# EAGLE schematic hsa_stm32_board (EAGLE 6.6.0)

## Sheet 1 of 3
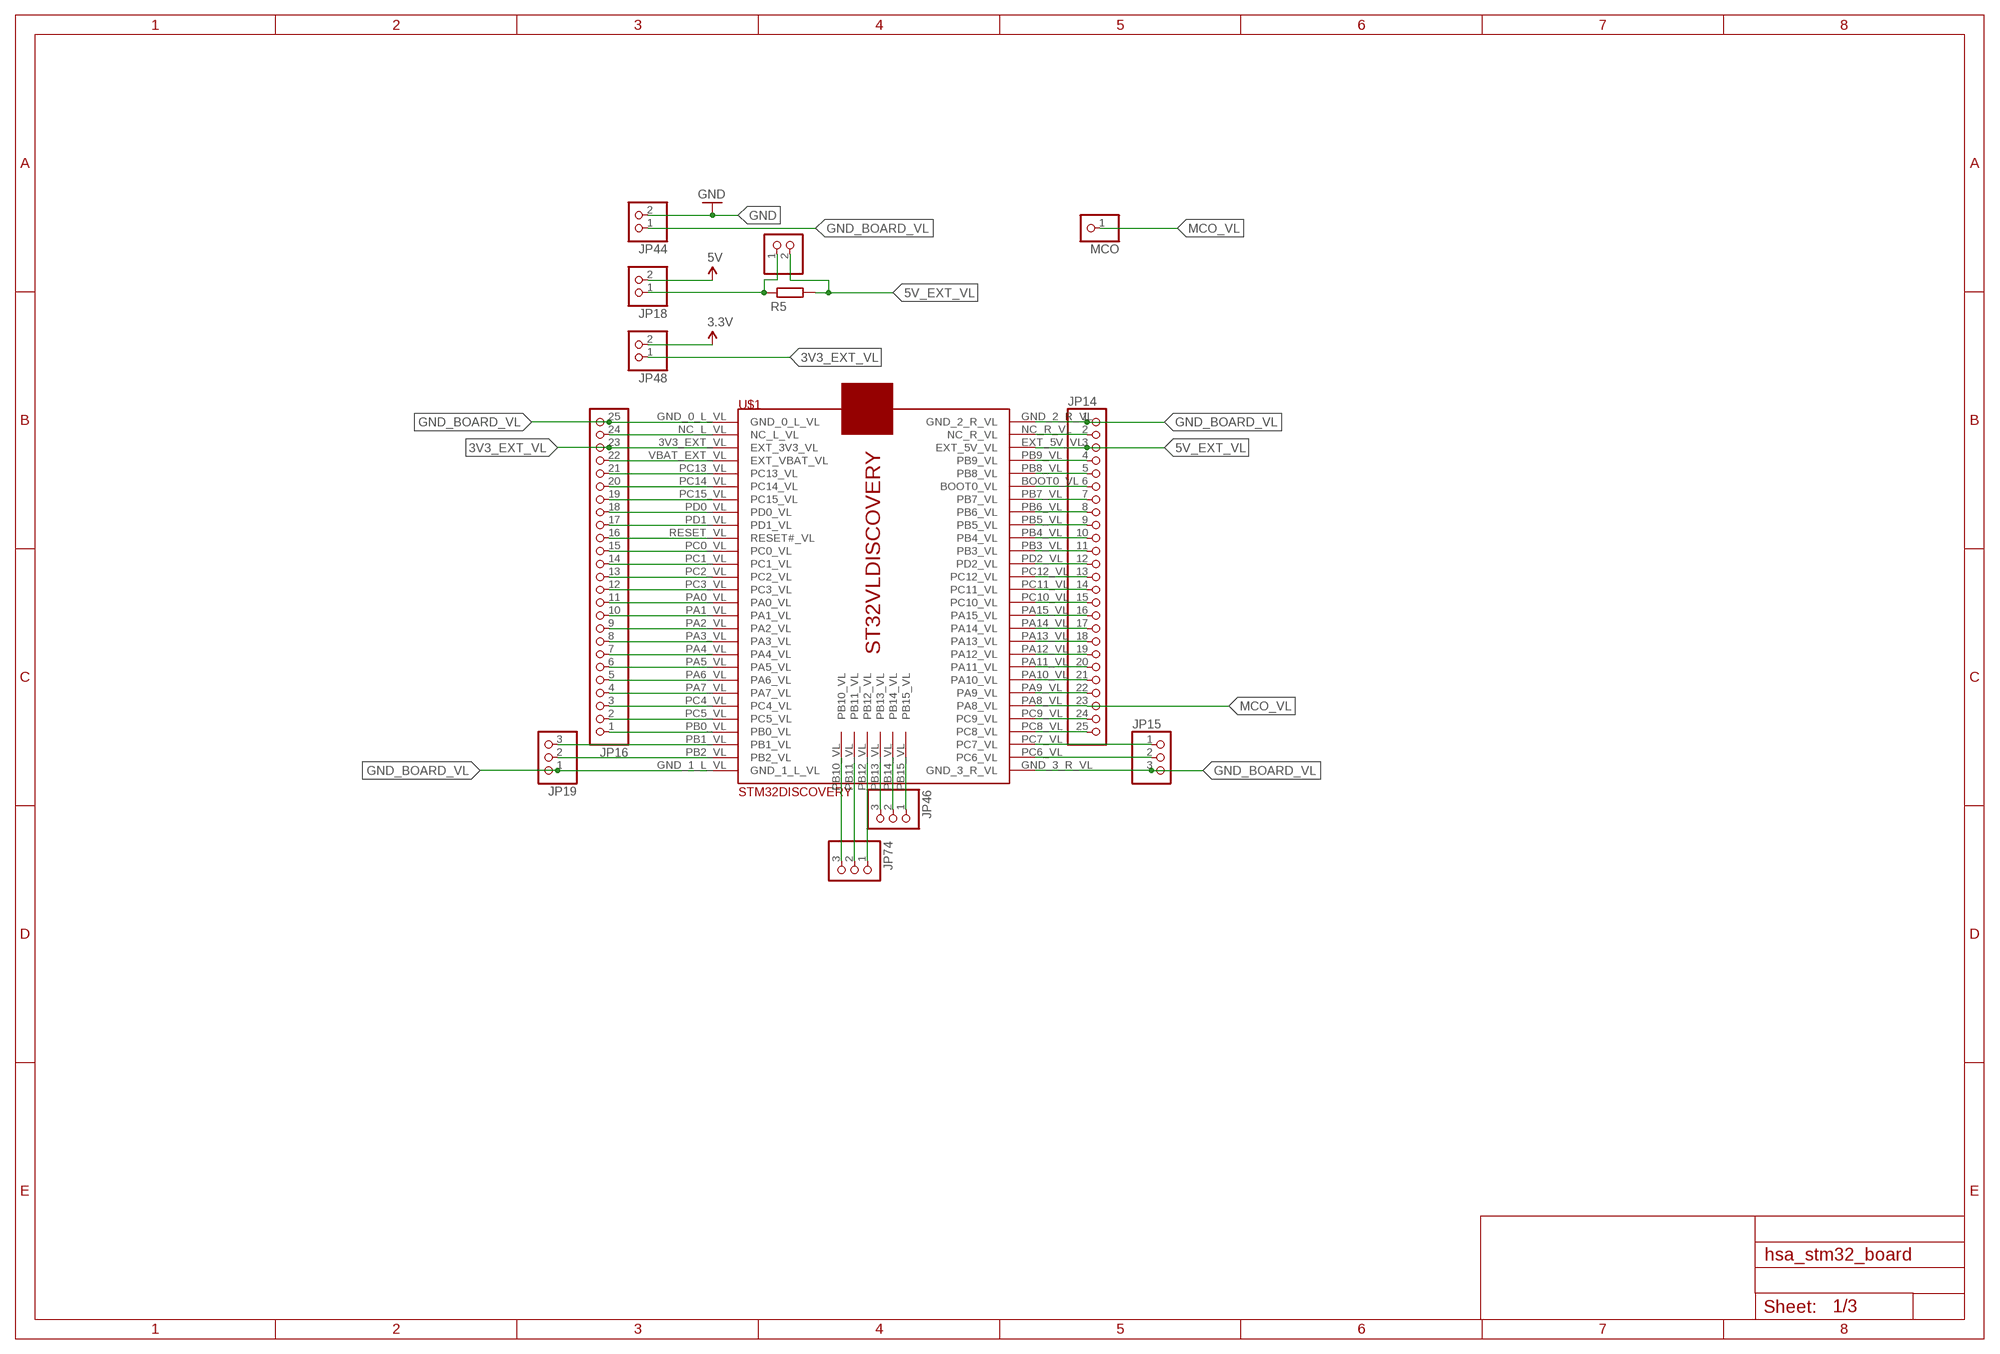
[diagram p0: schematic, sheet 1]

### Parts
JP14  PINHD-1X25  [1X25]
JP15  PINHD-1X3  [1X03]
JP16  PINHD-1X25  [1X25]
JP18  PINHD-1X2/90  [1X02/90]
JP19  PINHD-1X3  [1X03]
JP44  PINHD-1X2/90  [1X02/90]
JP46  PINHD-1X3  [1X03]
JP48  PINHD-1X2/90  [1X02/90]
JP74  PINHD-1X3  [1X03]
JP75  PINHD-1X2/90  [1X02/90]
MCO  PINHD-1X1  [1X01]
R5  R-EU_0207/10  [0207/10]
U$1  STM32DISCOVERY  [STM32DISCOVERY]

### Nets
3.3V: JP48.2 ; also sheet 2,3
3V3_EXT_VL: JP16.23 JP48.1 U$1.3V3_EXT_VL(EXT_3V3_VL)
5V: JP18.2 ; also sheet 2,3
5V_EXT_VL: JP14.3 JP75.2 R5.2 U$1.EXT_5V_VL
GND: JP44.2 ; also sheet 2,3
GND_BOARD_VL: JP14.1 JP15.3 JP16.25 JP19.1 JP44.1 U$1.GND_0_L_VL U$1.GND_1_L_VL U$1.GND_2_R_VL U$1.GND_3_R_VL
MCO_VL: JP14.23 MCO.1 U$1.PA8_VL
N$11: JP18.1 JP75.1 R5.1
N$33: JP14.2 U$1.NC_R_VL
N$35: JP14.4 U$1.PB9_VL
N$121: JP14.5 U$1.PB8_VL
N$129: JP14.6 U$1.BOOT0_VL
N$130: JP14.7 U$1.PB7_VL
N$137: JP14.8 U$1.PB6_VL
N$138: JP14.9 U$1.PB5_VL
N$154: JP14.10 U$1.PB4_VL
N$155: JP14.11 U$1.PB3_VL
N$156: JP14.12 U$1.PD2_VL
N$157: JP14.13 U$1.PC12_VL
N$158: JP14.14 U$1.PC11_VL
N$159: JP14.15 U$1.PC10_VL
N$160: JP14.16 U$1.PA15_VL
N$161: JP14.17 U$1.PA14_VL
N$162: JP14.18 U$1.PA13_VL
N$163: JP14.19 U$1.PA12_VL
N$164: JP14.20 U$1.PA11_VL
N$165: JP14.21 U$1.PA10_VL
N$166: JP14.22 U$1.PA9_VL
N$168: JP14.24 U$1.PC9_VL
N$169: JP14.25 U$1.PC8_VL
N$170: JP15.1 U$1.PC7_VL
N$171: JP15.2 U$1.PC6_VL
N$173: JP16.1 U$1.PB0_VL
N$174: JP16.2 U$1.PC5_VL
N$175: JP16.3 U$1.PC4_VL
N$176: JP16.4 U$1.PA7_VL
N$177: JP16.5 U$1.PA6_VL
N$178: JP16.6 U$1.PA5_VL
N$179: JP16.7 U$1.PA4_VL
N$180: JP16.8 U$1.PA3_VL
N$181: JP16.9 U$1.PA2_VL
N$182: JP16.10 U$1.PA1_VL
N$183: JP16.11 U$1.PA0_VL
N$184: JP16.12 U$1.PC3_VL
N$185: JP16.13 U$1.PC2_VL
N$186: JP16.14 U$1.PC1_VL
N$187: JP16.15 U$1.PC0_VL
N$188: JP16.16 U$1.RESET_VL(RESET#_VL)
N$189: JP16.17 U$1.PD1_VL
N$190: JP16.18 U$1.PD0_VL
N$191: JP16.19 U$1.PC15_VL
N$192: JP16.20 U$1.PC14_VL
N$193: JP16.21 U$1.PC13_VL
N$194: JP16.22 U$1.VBAT_EXT_VL(EXT_VBAT_VL)
N$196: JP16.24 U$1.NC_L_VL
N$199: JP19.2 U$1.PB2_VL
N$200: JP19.3 U$1.PB1_VL
N$201: JP46.1 U$1.PB15_VL
N$202: JP46.2 U$1.PB14_VL
N$203: JP46.3 U$1.PB13_VL
N$204: JP74.1 U$1.PB12_VL
N$205: JP74.2 U$1.PB11_VL
N$206: JP74.3 U$1.PB10_VL

## Sheet 2 of 3
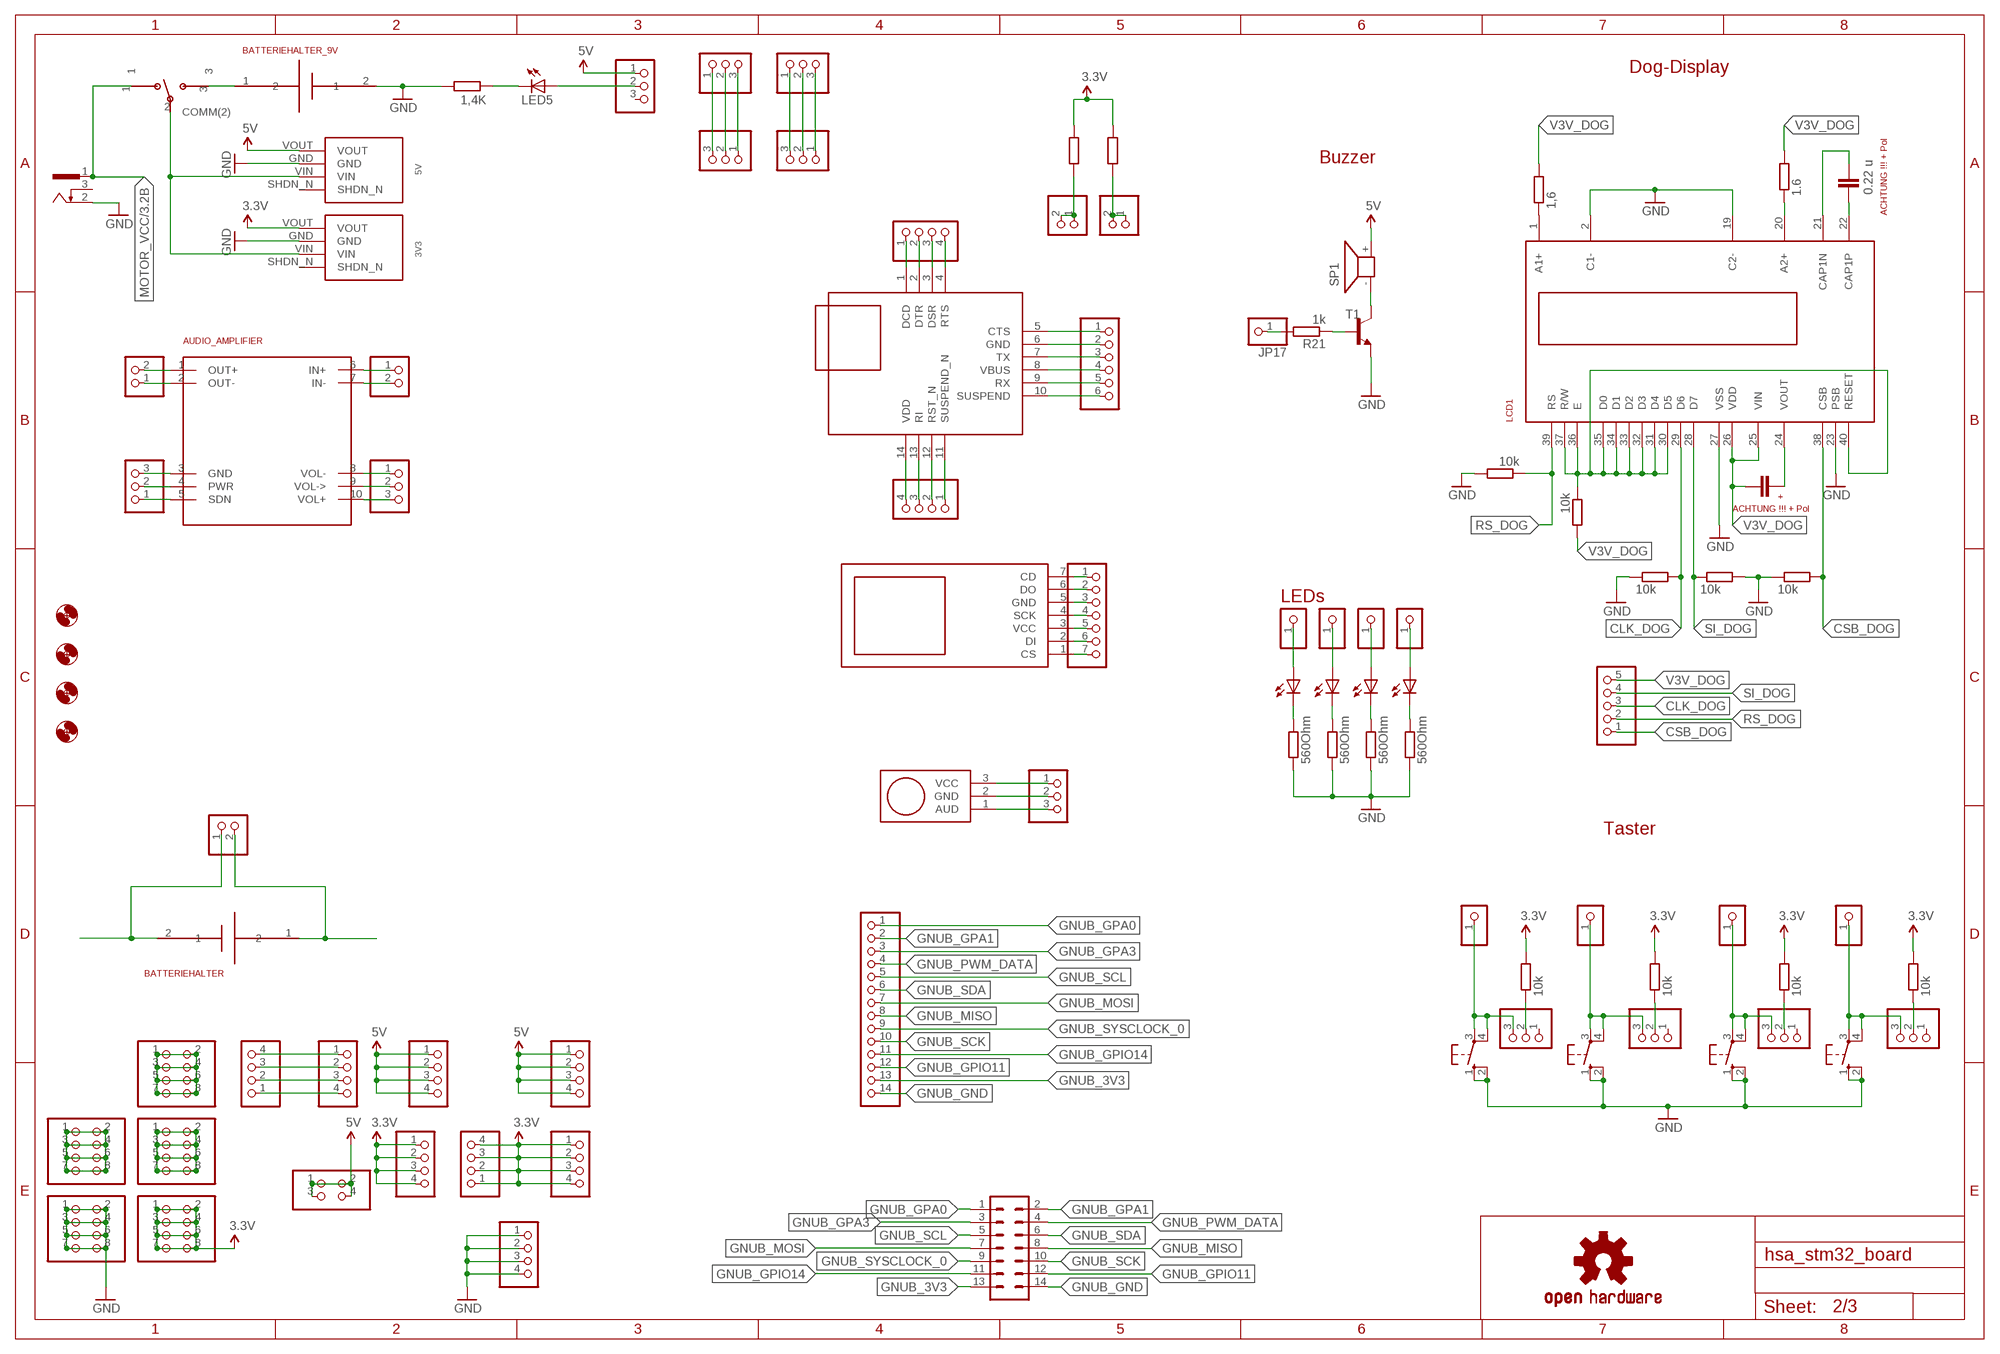
[diagram p1: schematic, sheet 2]

### Parts
3V3  VOLTAGE_REGULATOR  [VOL_REG]
5V  VOLTAGE_REGULATOR  [VOL_REG]
C2  0.22 u  C-EU025-040X050  [C025-040X050]
C3  1 u  C-EU025-040X050  [C025-040X050]
H1  MOUNT-HOLE2.8  [2,8]
H2  MOUNT-HOLE2.8  [2,8]
H3  MOUNT-HOLE2.8  [2,8]
H4  MOUNT-HOLE2.8  [2,8]
JP1  PINHD-1X5  [1X05]
JP4  PINHD-1X3  [1X03]
JP5  PINHD-1X1  [1X01]
JP6  PINHD-1X1  [1X01]
JP7  PINHD-1X1  [1X01]
JP8  PINHD-1X1  [1X01]
JP9  PINHD-1X1  [1X01]
JP10  PINHD-1X1  [1X01]
JP11  PINHD-1X1  [1X01]
JP12  PINHD-1X1  [1X01]
JP17  PINHD-1X1  [1X01]
JP24  PINHD-1X4  [1X04]
JP27  PINHD-1X4/90  [1X04/90]
JP28  PINHD-1X4  [1X04]
JP29  PINHD-1X4  [1X04]
JP30  PINHD-1X3  [1X03]
JP31  PINHD-1X2  [1X02]
JP32  PINHD-1X2  [1X02]
JP33  PINHD-1X3  [1X03]
JP34  PINHD-1X3  [1X03]
JP36  PINHD-1X4  [1X04]
JP37  PINHD-1X4  [1X04]
JP38  PINHD-1X6  [1X06]
JP39  PINHD-1X7  [1X07]
JP40  PINHD-1X4  [1X04]
JP41  PINHD-1X4  [1X04]
JP42  PINHD-1X4  [1X04]
JP43  PINHD-1X2  [1X02]
JP45  PINHD-2X4  [2X04]
JP47  PINHD-1X4  [1X04]
JP49  PINHD-1X3/90  [1X03/90]
JP50  PINHD-1X3  [1X03]
JP51  PINHD-1X3/90  [1X03/90]
JP52  PINHD-1X3  [1X03]
JP59  PINHD-1X3  [1X03]
JP60  PINHD-1X3  [1X03]
JP61  PINHD-1X3  [1X03]
JP62  PINHD-1X3  [1X03]
JP64  PINHD-1X14  [1X14]
JP65  PINHD-1X2  [1X02]
JP66  PINHD-1X2  [1X02]
JP67  PINHD-2X4  [2X04]
JP68  PINHD-2X4  [2X04]
JP69  PINHD-2X4  [2X04]
JP70  PINHD-2X4  [2X04]
JP71  PINHD-2X2  [2X02]
LCD1  ZEITERFASSUNG_-OPTO_DOGM  [ZEITERFASSUNG_-OPTO_DOGM]
LED1  LED5MM  [LED5MM]
LED2  LED5MM  [LED5MM]
LED3  LED5MM  [LED5MM]
LED4  LED5MM  [LED5MM]
LED5  LED5MM  [LED5MM]
LOGO1  OSHW-LOGOL  [OSHW-LOGO-L]
R1  560Ohm  R-EU_0207/10  [0207/10]
R2  560Ohm  R-EU_0207/10  [0207/10]
R3  560Ohm  R-EU_0207/10  [0207/10]
R4  560Ohm  R-EU_0207/10  [0207/10]
R6  1,4K  R-EU_0207/10  [0207/10]
R7  1.6  R-EU_0207/10  [0207/10]
R8  1,6  R-EU_0207/10  [0207/10]
R9  10k  R-EU_0207/10  [0207/10]
R10  10k  R-EU_0207/10  [0207/10]
R11  10k  R-EU_0207/10  [0207/10]
R12  10k  R-EU_0207/10  [0207/10]
R13  10k  R-EU_0207/10  [0207/10]
R14  10k  R-EU_0207/10  [0207/10]
R15  10k  R-EU_0207/10  [0207/10]
R16  10k  R-EU_0207/10  [0207/10]
R17  10k  R-EU_0207/10  [0207/10]
R21  1k  R-EU_0207/10  [0207/10]
R22  R-EU_0207/10  [0207/10]
R23  R-EU_0207/10  [0207/10]
S1  CPU-K_MODULE_REV3.0_SWITCH-OMRON_10-XX  [CPU-K_MODULE_REV3.0_SWITCH-OMRON_B3F-10XX]
S2  CPU-K_MODULE_REV3.0_SWITCH-OMRON_10-XX  [CPU-K_MODULE_REV3.0_SWITCH-OMRON_B3F-10XX]
S3  CPU-K_MODULE_REV3.0_SWITCH-OMRON_10-XX  [CPU-K_MODULE_REV3.0_SWITCH-OMRON_B3F-10XX]
S4  CPU-K_MODULE_REV3.0_SWITCH-OMRON_10-XX  [CPU-K_MODULE_REV3.0_SWITCH-OMRON_B3F-10XX]
SP1  BUZZER_F/PMX04  [BUZZER_F/PMX04A]
SV3  ML14  [ML14]
T1  TRANSISTOR_BC337  [TRANSISTOR_TO92]
U$2  USB_TO_SERIAL_ADAPTER  [USB_TO_SERIAL]
U$4  KIPPSCHALTER(EIN,AUS,EIN)  [KIPPSCHALTER]
U$5  MIC  [MIC]
U$6  BATTERIEHALTER  [BH_KZH_20]
U$7  BATTERIEHALTER_9V  [BATTERIEHALTER_9V]
U$9  AUDIO_AMPLIFIER  [AUDIO_AMPLIFIER]
U$12  MICRO_SD_HALTER  [MIKRO_SD_HALTER]
X1  733980-62  [733980-62]

### Nets
3.3V: 3V3.VOUT JP29.1 JP29.2 JP29.3 JP29.4 JP41.1 JP41.2 JP41.3 JP41.4 JP47.1 JP47.2 JP47.3 JP47.4 JP70.1 JP70.2 JP70.3 JP70.4 JP70.5 JP70.6 JP70.7 JP70.8 R14.2 R15.2 R16.2 R17.2 R22.2 R23.2 ; also sheet 1,3
5V: 5V.VOUT JP4.1 JP28.1 JP28.2 JP28.3 JP28.4 JP40.1 JP40.2 JP40.3 JP40.4 JP71.1 JP71.2 JP71.3 JP71.4 SP1.+ ; also sheet 1,3
CLK_DOG: JP1.3 LCD1.29(D6) R11.2
CSB_DOG: JP1.1 LCD1.38(CSB) R13.2
GND: 3V3.GND 5V.GND JP42.1 JP42.2 JP42.3 JP42.4 JP67.1 JP67.2 JP67.3 JP67.4 JP67.5 JP67.6 JP67.7 JP67.8 LCD1.2(C1-) LCD1.19(C2-) LCD1.23(PSB) LCD1.27(VSS) R1.1 R2.1 R3.1 R4.1 R6.2 R9.2 R11.1 R12.2 R13.1 S1.1(S) S1.2(S1) S2.1(S) S2.2(S1) S3.1(S) S3.2(S1) S4.1(S) S4.2(S1) T1.1(E) U$7.2 X1.2 ; also sheet 1,3
GNUB_3V3: JP64.13 SV3.13
GNUB_GND: JP64.14 SV3.14
GNUB_GPA0: JP64.1 SV3.1
GNUB_GPA1: JP64.2 SV3.2
GNUB_GPA3: JP64.3 SV3.3
GNUB_GPIO11: JP64.12 SV3.12
GNUB_GPIO14: JP64.11 SV3.11
GNUB_MISO: JP64.8 SV3.8
GNUB_MOSI: JP64.7 SV3.7
GNUB_PWM_DATA: JP64.4 SV3.4
GNUB_SCK: JP64.10 SV3.10
GNUB_SCL: JP64.5 SV3.5
GNUB_SDA: JP64.6 SV3.6
GNUB_SYSCLOCK_0: JP64.9 SV3.9
MOTOR_VCC: U$4.1 X1.1 ; also sheet 3
N$1: C2.2 LCD1.22(CAP1P)
N$2: C2.1 LCD1.21(CAP1N)
N$3: LCD1.20(A2+) R7.1
N$4: LCD1.30(D5) LCD1.31(D4) LCD1.32(D3) LCD1.33(D2) LCD1.34(D1) LCD1.35(D0) LCD1.36(E) LCD1.37(R/W) LCD1.40(RESET) R10.1
N$5: LCD1.1(A1+) R8.1
N$6: C3.2 LCD1.24(VOUT)
N$7: LED4.K(C) R4.2
N$8: LED3.K(C) R3.2
N$9: LED2.K(C) R2.2
N$10: LED1.K(C) R1.2
N$13: JP6.1 LED2.A
N$14: JP7.1 LED3.A
N$15: JP8.1 LED4.A
N$16: 3V3.VIN 5V.VIN U$4.2(COMM(2))
N$18: JP62.2 R14.1
N$19: JP61.2 R15.1
N$20: JP9.1 JP62.3 S1.3(P) S1.4(P1)
N$21: JP10.1 JP61.3 S2.3(P) S2.4(P1)
N$22: JP60.2 R16.1
N$23: JP59.2 R17.1
N$24: JP11.1 JP60.3 S3.3(P) S3.4(P1)
N$25: JP12.1 JP59.3 S4.3(P) S4.4(P1)
N$27: U$4.3 U$7.1
N$28: LED5.K(C) R6.1
N$29: JP4.2 LED5.A
N$30: JP5.1 LED1.A
N$36: SP1.- T1.3(C)
N$37: JP43.1 U$6.2
N$39: JP17.1 R21.2
N$40: JP43.2 U$6.1
N$58: JP24.4 JP27.1
N$62: JP24.3 JP27.2
N$63: JP24.2 JP27.3
N$64: JP24.1 JP27.4
N$65: JP32.2 U$9.1(OUT+)
N$66: JP32.1 U$9.2(OUT-)
N$67: JP31.1 U$9.6(IN+)
N$68: JP31.2 U$9.7(IN-)
N$69: JP34.1 U$9.8(VOL-)
N$70: JP49.3 JP50.1
N$71: JP49.2 JP50.2
N$72: JP49.1 JP50.3
N$73: JP30.1 U$5.3(VCC)
N$74: JP30.2 U$5.2(GND)
N$75: JP30.3 U$5.1(AUD)
N$76: JP34.2 U$9.9(VOL->)
N$77: JP34.3 U$9.10(VOL+)
N$78: JP33.3 U$9.3(GND)
N$79: JP33.2 U$9.4(PWR)
N$80: JP33.1 U$9.5(SDN)
N$88: JP36.1 U$2.1(DCD)
N$89: JP36.2 U$2.2(DTR)
N$90: JP36.3 U$2.3(DSR)
N$91: JP36.4 U$2.4(RTS)
N$92: JP37.1 U$2.11(SUSPEND_N)
N$93: JP37.2 U$2.12(RST_N)
N$94: JP37.3 U$2.13(RI)
N$95: JP37.4 U$2.14(VDD)
N$96: JP38.1 U$2.5(CTS)
N$97: JP38.2 U$2.6(GND)
N$98: JP38.3 U$2.7(TX)
N$99: JP38.4 U$2.8(VBUS)
N$100: JP38.5 U$2.9(RX)
N$101: JP38.6 U$2.10(SUSPEND)
N$102: JP39.1 U$12.7(CD)
N$103: JP39.2 U$12.6(DO)
N$104: JP39.3 U$12.5(GND)
N$105: JP39.4 U$12.4(SCK)
N$106: JP39.5 U$12.3(VCC)
N$107: JP39.6 U$12.2(DI)
N$108: JP39.7 U$12.1(CS)
N$109: JP51.3 JP52.1
N$110: JP51.2 JP52.2
N$111: JP51.1 JP52.3
N$112: R21.1 T1.2(B)
N$125: JP65.1 JP65.2 R23.1
N$126: JP66.1 JP66.2 R22.1
N$132: JP45.1 JP45.2 JP45.3 JP45.4 JP45.5 JP45.6 JP45.7 JP45.8
N$136: JP68.1 JP68.2 JP68.3 JP68.4 JP68.5 JP68.6 JP68.7 JP68.8
N$140: JP69.1 JP69.2 JP69.3 JP69.4 JP69.5 JP69.6 JP69.7 JP69.8
RS_DOG: JP1.2 LCD1.39(RS) R9.1
SI_DOG: JP1.4 LCD1.28(D7) R12.1
V3V_DOG: C3.1 JP1.5 LCD1.25(VIN) LCD1.26(VDD) R7.2 R8.2 R10.2
Unconnected: 3V3.SHDN_N 5V.SHDN_N JP4.3 JP59.1 JP60.1 JP61.1 JP62.1 X1.3

### Notes on the sheet
- Dog-Display
- Buzzer
- ACHTUNG !!! + Pol
- +
- ACHTUNG !!! + Pol
- LEDs
- Taster

## Sheet 3 of 3
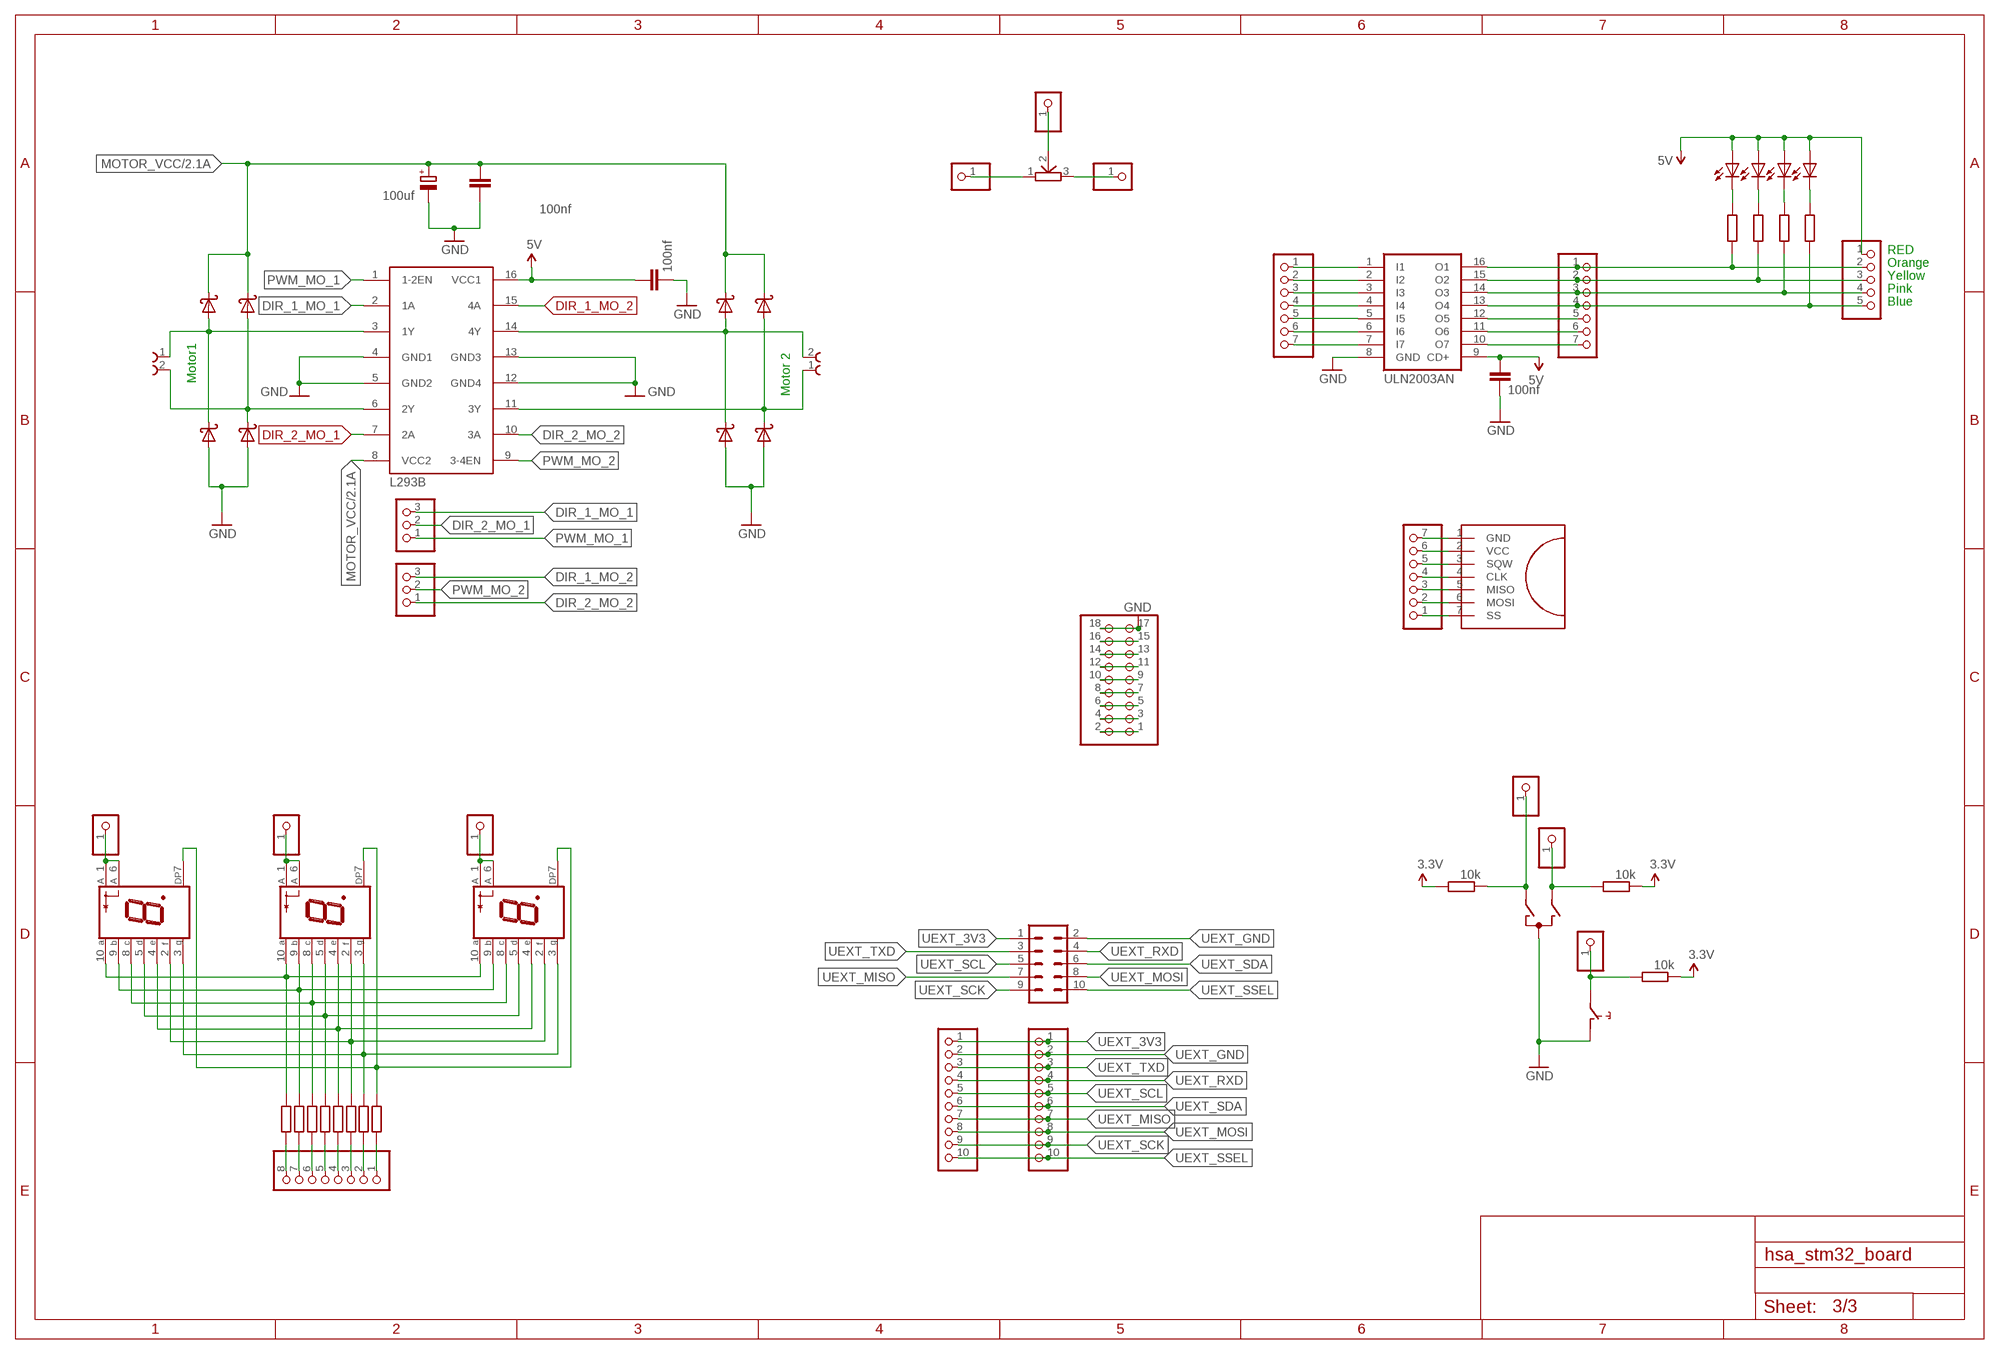
[diagram p2: schematic, sheet 3]

### Parts
C4  100nf  RCL_C-EU025-040X050  [RCL_C025-040X050]
C5  100nf  RCL_C-EU025-040X050  [RCL_C025-040X050]
C6  100nf  RCL_C-EU025-040X050  [RCL_C025-040X050]
C7  100uf  RCL_CPOL-EUE2.5-6  [RCL_E2,5-6]
D1  1N5819  [DO41-10]
D2  1N5819  [DO41-10]
D3  1N5819  [DO41-10]
D4  1N5819  [DO41-10]
D5  1N5819  [DO41-10]
D6  1N5819  [DO41-10]
D7  1N5819  [DO41-10]
D8  1N5819  [DO41-10]
IC1  ULN2003AN  [DIL16]
IC2  L293D  [DIL16]
JP2  PINHD-1X1  [1X01]
JP3  PINHD-1X1  [1X01]
JP13  PINHD-1X1  [1X01]
JP20  PINHD-1X10  [1X10]
JP21  PINHD-1X7  [1X07]
JP22  PINHD-1X8  [1X08]
JP23  PINHD-1X1  [1X01]
JP25  PINHD-1X5/90  [1X05/90]
JP26  PINHD-1X7  [1X07]
JP35  PINHD-1X7  [1X07]
JP53  PINHD-1X1  [1X01]
JP54  PINHD-1X1  [1X01]
JP55  PINHD-1X1  [1X01]
JP56  PINHD-2X9  [2X09]
JP57  PINHD-1X3  [1X03]
JP58  PINHD-1X3  [1X03]
JP63  PINHD-1X10  [1X10]
JP72  PINHD-1X1  [1X01]
JP73  PINHD-1X1  [1X01]
K1  691210910002  [691210910002]
K2  691210910002  [691210910002]
LED6  LA-401MD  [LA-401]
LED7  LA-401MD  [LA-401]
LED8  LA-401MD  [LA-401]
LED9  LED3MM  [LED3MM]
LED10  LED3MM  [LED3MM]
LED11  LED3MM  [LED3MM]
LED12  LED3MM  [LED3MM]
R18  10k  R-EU_0207/10  [0207/10]
R19  10k  R-EU_0207/10  [0207/10]
R20  10k  R-EU_0207/10  [0207/10]
R24  R-EU_0207/10  [0207/10]
R25  R-EU_0207/10  [0207/10]
R26  R-EU_0207/10  [0207/10]
R27  R-EU_0207/10  [0207/10]
R28  R-EU_0207/10  [0207/10]
R29  R-EU_0207/10  [0207/10]
R30  R-EU_0207/10  [0207/10]
R31  R-EU_0207/10  [0207/10]
R32  R-EU_0207/10  [0207/10]
R33  R-EU_0207/10  [0207/10]
R34  R-EU_0207/10  [0207/10]
R35  R-EU_0207/10  [0207/10]
SV2  CON-HARTING-ML_ML10  [CON-HARTING-ML_ML10]
SW1  EC12E_SW  [ALPS_EC12E_SW]
U$10  RTC  [RTC]
U$17  THUMBWHEEL_POTI  [THUMBWHEEL_POTI]

### Nets
3.3V: R18.1 R19.2 R20.1 ; also sheet 1,2
5V: C4.1 C6.1 IC1.9(CD+) IC2.16(VCC1) JP25.1 LED9.A LED10.A LED11.A LED12.A ; also sheet 1,2
DIR_1_MO_1: IC2.2(1A) JP57.3
DIR_1_MO_2: IC2.15(4A) JP58.3
DIR_2_MO_1: IC2.7(2A) JP57.2
DIR_2_MO_2: IC2.10(3A) JP58.1
GND: C4.2 C5.2 C6.2 C7.- D3.A D4.A D7.A D8.A IC1.8(GND) IC2.4(GND1) IC2.5(GND2) IC2.12(GND4) IC2.13(GND3) JP56.17 JP56.18 SW1.C SW1.D ; also sheet 1,2
MOTOR_VCC: C5.1 C7.+ D1.C D2.C D5.C D6.C IC2.8(VCC2) ; also sheet 2
N$12: JP2.1 R19.1 SW1.A
N$17: LED9.K(C) R32.2
N$26: LED10.K(C) R34.2
N$31: JP3.1 R18.2 SW1.B
N$32: JP13.1 R20.2 SW1.E
N$38: D2.A D4.C IC2.14(4Y) K1.2
N$41: IC1.12(O5) JP21.5
N$42: IC1.11(O6) JP21.6
N$43: IC1.10(O7) JP21.7
N$44: IC1.5(I5) JP26.5
N$45: IC1.16(O1) JP21.1 JP25.2 R32.1
N$46: IC1.15(O2) JP21.2 JP25.3 R34.1
N$47: IC1.6(I6) JP26.6
N$48: IC1.7(I7) JP26.7
N$49: JP56.1 JP56.2
N$50: JP56.3 JP56.4
N$51: IC1.14(O3) JP21.3 JP25.4 R33.1
N$52: IC1.13(O4) JP21.4 JP25.5 R35.1
N$53: JP56.5 JP56.6
N$54: IC1.4(I4) JP26.4
N$55: IC1.3(I3) JP26.3
N$56: IC1.2(I2) JP26.2
N$57: IC1.1(I1) JP26.1
N$59: JP56.7 JP56.8
N$60: JP56.9 JP56.10
N$61: JP56.11 JP56.12
N$81: JP35.1 U$10.7(SS)
N$82: JP35.2 U$10.6(MOSI)
N$83: JP35.3 U$10.5(MISO)
N$84: JP35.4 U$10.4(CLK)
N$85: JP35.5 U$10.3(SQW)
N$86: JP35.6 U$10.2(VCC)
N$87: JP35.7 U$10.1(GND)
N$113: D1.A D3.C IC2.11(3Y) K1.1
N$114: JP55.1 U$17.1(A)
N$115: JP54.1 U$17.2(W)
N$116: D6.A D8.C IC2.3(1Y) K2.1
N$117: D5.A D7.C IC2.6(2Y) K2.2
N$118: JP53.1 U$17.3(B)
N$119: LED12.K(C) R35.2
N$120: LED11.K(C) R33.2
N$122: JP56.13 JP56.14
N$123: JP56.15 JP56.16
N$127: JP22.8 R24.1
N$131: LED6.9(B) LED7.9(B) LED8.9(B) R25.2
N$133: LED6.8(C) LED7.8(C) LED8.8(C) R26.2
N$134: LED6.5(D) LED7.5(D) LED8.5(D) R27.2
N$135: LED6.4(E) LED7.4(E) LED8.4(E) R28.2
N$139: LED6.2(F) LED7.2(F) LED8.2(F) R29.2
N$141: LED6.3(G) LED7.3(G) LED8.3(G) R30.2
N$142: LED6.7(DP) LED7.7(DP) LED8.7(DP) R31.2
N$143: LED6.10(A) LED7.10(A) LED8.10(A) R24.2
N$144: JP22.7 R25.1
N$145: JP22.6 R26.1
N$146: JP22.5 R27.1
N$147: JP22.4 R28.1
N$148: JP22.3 R29.1
N$149: JP22.2 R30.1
N$150: JP22.1 R31.1
N$151: JP72.1 LED6.1(A) LED6.6(A)
N$152: JP73.1 LED7.1(A) LED7.6(A)
N$153: JP23.1 LED8.1(A) LED8.6(A)
PWM_MO_1: IC2.1(1-2EN) JP57.1
PWM_MO_2: IC2.9(3-4EN) JP58.2
UEXT_3V3: JP20.1 JP63.1 SV2.1
UEXT_GND: JP20.2 JP63.2 SV2.2
UEXT_MISO: JP20.7 JP63.7 SV2.7
UEXT_MOSI: JP20.8 JP63.8 SV2.8
UEXT_RXD: JP20.4 JP63.4 SV2.4
UEXT_SCK: JP20.9 JP63.9 SV2.9
UEXT_SCL: JP20.5 JP63.5 SV2.5
UEXT_SDA: JP20.6 JP63.6 SV2.6
UEXT_SSEL: JP20.10 JP63.10 SV2.10
UEXT_TXD: JP20.3 JP63.3 SV2.3
Unconnected: SW1.GND1(G) SW1.GND2(G)

### Notes on the sheet
- RED
- Orange
- Yellow
- Pink
- Blue
- Motor1
- Motor 2
- L293B

## Library data of the parts
3V3 5V = hsa_stm32_discovery_board:VOLTAGE_REGULATOR
C2 C3 = resistor:C-EU: CAPACITOR, European symbol
C4-C6 = v100_knicker:RCL_C-EU: CAPACITOR, European symbol
C7 = CPU-k_module_Rev3.0:RCL_CPOL-EU: POLARIZED CAPACITOR, European symbol
D1-D8 = CEDT:1N5819: DIODE general purpose rectifier, 1 A
H1-H4 = holes:MOUNT-HOLE: MOUNTING HOLE with drill center marker
IC1 = uln-udn:ULN2003A: DRIVER ARRAY
IC2 = st-microelectronics:L293D: PUSH-PULL 4 CHANNEL DRIVER; MPN: L293D; OC_FARNELL: 9589619; OC_NEWARK: 56P8249
JP1 JP25 = pinhead:PINHD-1X5: PIN HEADER
JP2 JP3 JP5-JP13 JP17 JP23 JP53-JP55 JP72 JP73 MCO = pinhead:PINHD-1X1: PIN HEADER
JP4 JP15 JP19 JP30 JP33 JP34 JP46 JP49-JP52 JP57-JP62 JP74 = pinhead:PINHD-1X3: PIN HEADER
JP14 JP16 = pinhead:PINHD-1X25: PIN HEADER
JP18 JP31 JP32 JP43 JP44 JP48 JP65 JP66 JP75 = pinhead:PINHD-1X2: PIN HEADER
JP20 JP63 = pinhead:PINHD-1X10: PIN HEADER
JP21 JP26 JP35 JP39 = pinhead:PINHD-1X7: PIN HEADER
JP22 = pinhead:PINHD-1X8: PIN HEADER
JP24 JP27-JP29 JP36 JP37 JP40-JP42 JP47 = pinhead:PINHD-1X4: PIN HEADER
JP38 = pinhead:PINHD-1X6: PIN HEADER
JP45 JP67-JP70 = pinhead:PINHD-2X4: PIN HEADER
JP56 = pinhead:PINHD-2X9: PIN HEADER
JP64 = pinhead:PINHD-1X14: PIN HEADER
JP71 = pinhead:PINHD-2X2: PIN HEADER
K1 K2 = Wuerth_Elektronik_eiCan_14_Terminal_Blocks_WR-TBL_2_0:691210910002: WR-TBL Serie 2109 - 2.54mm Horizontal Entry Modular with Rising Cage Clamp - 0.8mm2 Wires, 2 Pins
LCD1 = elatus:ZEITERFASSUNG_-OPTO_DOGM
LED1-LED5 LED9-LED12 = led:LED: LED OSRAM: - CHIPLED LG R971, LG N971, LY N971, LG Q971, LY Q971, LO R971, LY R971 LH N974, LH R974 LS Q976, LO Q976, LY Q976 LO Q996 - Hyper CHIPLED LW Q18S LB Q993, LB Q99A, LB R99A - SideLED LS A670, LO A670, LY A670, LG A670, LP A670 LB A673, LV A673, LT A673, LW A673 LH A674 LY A675 LS A676, LA A676, LO A676, LY A676, LW A676 LS A679, LY A679, LG A679 - Hyper Micro SIDELED® LS Y876, LA Y876, LO Y876, LY Y876 LT Y87S - SmartLED LW L88C, LW L88S LB L89C, LB L89S, LG L890 LS L89K, LO L89K, LY L89K LS L896, LA L896, LO L896, LY L896 - TOPLED LS T670, LO T670, LY T670, LG T670, LP T670 LSG T670, LSP T670, LSY T670, LOP T670, LYG T670 LG T671, LOG T671, LSG T671 LB T673, LV T673, LT T673, LW T673 LH T674 LS T676, LA T676, LO T676, LY T676, LB T676, LH T676, LSB T676, LW T676 LB T67C, LV T67C, LT T67C, LS T67K, LO T67K, LY T67K, LW E67C LS E67B, LA E67B, LO E67B, LY E67B, LB E67C, LV E67C, LT E67C LW T67C LS T679, LY T679, LG T679 LS T770, LO T770, LY T770, LG T770, LP T770 LB T773, LV T773, LT T773, LW T773 LH T774 LS E675, LA E675, LY E675, LS T675 LS T776, LA T776, LO T776, LY T776, LB T776 LHGB T686 LT T68C, LB T68C - Hyper Mini TOPLED® LB M676 - Mini TOPLED Santana® LG M470 LS M47K, LO M47K, LY M47K Source: http://www.osram.convergy.de LUXEON: - LUMILED® LXK2-PW12-R00, LXK2-PW12-S00, LXK2-PW14-U00, LXK2-PW14-V00 LXK2-PM12-R00, LXK2-PM12-S00, LXK2-PM14-U00 LXK2-PE12-Q00, LXK2-PE12-R00, LXK2-PE12-S00, LXK2-PE14-T00, LXK2-PE14-U00 LXK2-PB12-K00, LXK2-PB12-L00, LXK2-PB12-M00, LXK2-PB14-N00, LXK2-PB14-P00, LXK2-PB14-Q00 LXK2-PR12-L00, LXK2-PR12-M00, LXK2-PR14-Q00, LXK2-PR14-R00 LXK2-PD12-Q00, LXK2-PD12-R00, LXK2-PD12-S00 LXK2-PH12-R00, LXK2-PH12-S00 LXK2-PL12-P00, LXK2-PL12-Q00, LXK2-PL12-R00 Source: www.luxeon.com KINGBRIGHT: KA-3528ASYC Source: www.kingbright.com
LED6-LED8 = led-7-segment:LA-401*D: Single Digit LED Numeric Display (anode common) Source: ROHM .. la-1401dn.pdf; OC_FARNELL: unknown; OC_NEWARK: unknown
LOGO1 = SparkFun-Aesthetics:OSHW-LOGO: Open Source Hardware Logo This logo indicates the piece of hardware it is found on incorporates a OSHW license and/or adheres to the definition of open source hardware found here: http://freedomdefined.org/OSHW
R1-R35 = rcl:R-EU_: RESISTOR, European symbol
S1-S4 = elatus:CPU-K_MODULE_REV3.0_SWITCH-OMRON_10-XX: OMRON SWITCH
SP1 = CPU-k_module_Rev3.0:BUZZER_F/PMX04: SPEAKER Source: Buerklin
SV2 = CPU-k_module_Rev3.0:CON-HARTING-ML_ML10: HARTING
SV3 = con-harting-ml:ML14: HARTING; OC_FARNELL: unknown; OC_NEWARK: unknown
SW1 = switch-alps:EC12E_SW: ALPS rotary Encoder EC12E series with switch; MPN: EC12E2424407; OC_FARNELL: 1520813; OC_NEWARK: 74M1068
T1 = elatus:TRANSISTOR_BC337: NPN TRANSISTOR
U$1 = hsa_stm32_discovery_board:STM32DISCOVERY
U$2 = hsa_stm32_discovery_board:USB_TO_SERIAL_ADAPTER
U$4 = hsa_stm32_discovery_board:KIPPSCHALTER(EIN,AUS,EIN)
U$5 = hsa_stm32_discovery_board:MIC
U$6 = hsa_stm32_discovery_board:BATTERIEHALTER
U$7 = hsa_stm32_discovery_board:BATTERIEHALTER_9V
U$9 = hsa_stm32_discovery_board:AUDIO_AMPLIFIER
U$10 = hsa_stm32_discovery_board:RTC
U$12 = hsa_stm32_discovery_board:MICRO_SD_HALTER
U$17 = hsa_stm32_discovery_board:THUMBWHEEL_POTI
X1 = con-conrad:73398?: FEMALE PRINT CONNECTOR Niedervolt-Steckverbinder Distributor Conrad